# EAGLE design top_hk2 (EAGLE 9.3.1)
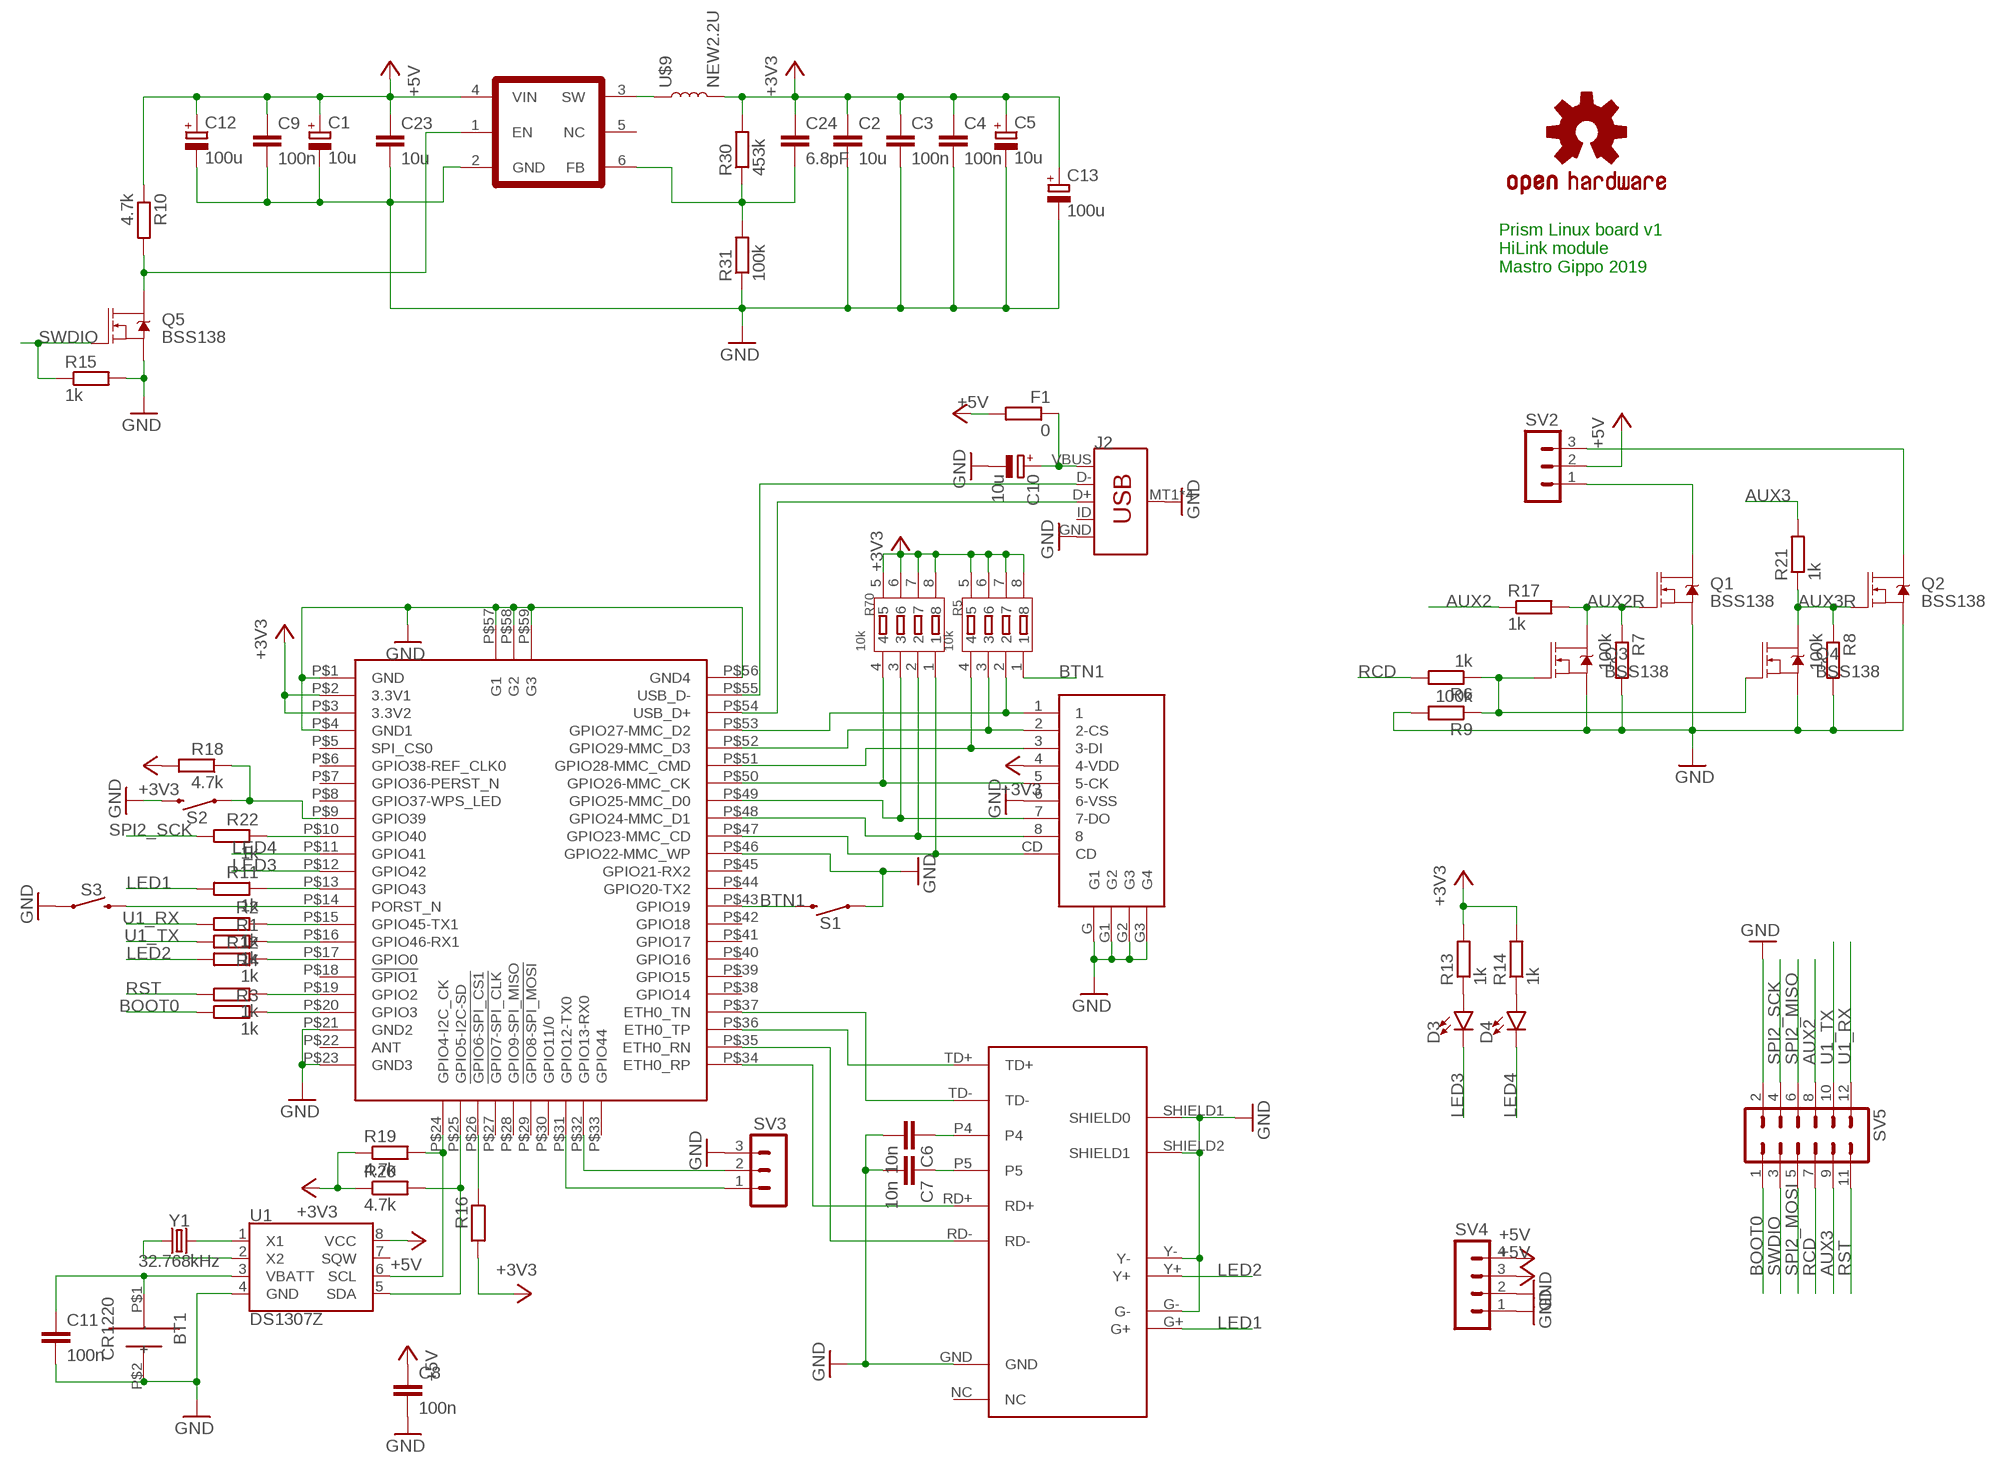
[diagram p0: schematic, sheet 1]

## Parts
BT1  CR1220  [CR1220]
C1  10u  CPOL-EUB/3528-21R  [B/3528-21R]
C2  10u  C-EUC0805K  [C0805K]
C3  100n  C-EUC0805K  [C0805K]
C4  100n  C-EUC0805K  [C0805K]
C5  10u  CPOL-EUB/3528-21R  [B/3528-21R]
C6  10n  C-EUC0805K  [C0805K]
C7  10n  C-EUC0805K  [C0805K]
C8  100n  C-EUC0805K  [C0805K]
C9  100n  C-EUC0805K  [C0805K]
C10  10u  CPOL-EUB/3528-21R  [B/3528-21R]
C11  100n  C-EUC0805K  [C0805K]
C12  100u  CPOL-EU153CLV-0505  [153CLV-0505]
C13  100u  CPOL-EU153CLV-0505  [153CLV-0505]
C23  10u  C-EUC0805K  [C0805K]
C24  6.8pF  C-EUC0805K  [C0805K]
D3  LED1206  [LED-1206]
D4  LED1206  [LED-1206]
F1  0  R-EU_R0603  [R0603]
J2  USB_MICRO-B_SMT  [USB-MICROB]
Q1  BSS138  MOSFET-NCH-BSS138  [SOT23-3]
Q2  BSS138  MOSFET-NCH-BSS138  [SOT23-3]
Q3  BSS138  MOSFET-NCH-BSS138  [SOT23-3]
Q4  BSS138  MOSFET-NCH-BSS138  [SOT23-3]
Q5  BSS138  MOSFET-NCH-BSS138  [SOT23-3]
R1  1k  R-EU_R0805  [R0805]
R2  1k  R-EU_R0805  [R0805]
R3  1k  R-EU_R0805  [R0805]
R4  1k  R-EU_R0805  [R0805]
R5  10k  SMD-RES-ARRAY-1K-4R(RA1206-8)  [RA1206-8]
R6  1k  R-EU_R0805  [R0805]
R7  100k  R-EU_R0805  [R0805]
R8  100k  R-EU_R0805  [R0805]
R9  100k  R-EU_R0805  [R0805]
R10  4.7k  R-EU_R0805  [R0805]
R11  1k  R-EU_R0805  [R0805]
R12  1k  R-EU_R0805  [R0805]
R13  1k  R-EU_R0805  [R0805]
R14  1k  R-EU_R0805  [R0805]
R15  1k  R-EU_R0805  [R0805]
R16  R-EU_R0805  [R0805]
R17  1k  R-EU_R0805  [R0805]
R18  4.7k  R-EU_R0805  [R0805]
R19  4.7k  R-EU_R0805  [R0805]
R20  4.7k  R-EU_R0805  [R0805]
R21  1k  R-EU_R0805  [R0805]
R22  1k  R-EU_R0805  [R0805]
R30  453k  R_EU  [R0805]
R31  100k  R_EU  [R0805]
R70  10k  SMD-RES-ARRAY-1K-4R(RA1206-8)  [RA1206-8]
S1  MOMENTARY-SWITCH-SPST-SMD-6.0X3.5MM  [TACTILE_SWITCH_SMD_6.0X3.5MM]
S2  MOMENTARY-SWITCH-SPST-SMD-6.0X3.5MM  [TACTILE_SWITCH_SMD_6.0X3.5MM]
S3  MOMENTARY-SWITCH-SPST-PTH-RIGHT-ANGLE  [TACTILE_SWITCH_PTH_RIGHT_ANGLE]
SV2  MA03-1  [MA03-1]
SV3  MA03-1  [MA03-1]
SV4  MA04-1  [MA04-1]
SV5  MA06-2  [MA06-2]
U1  DS1307Z  [SO08-0.15]
U$1  OSHW-LOGOS  [OSHW-LOGO-S]
U$2  HLK-7688A  [HLK-7688A]
U$3  MICRO_SD  [MICRO_SD_C]
U$4  HR911105A  [RJ45]
U$8  TLV62658  [SOT23-6]
U$9  NEW2.2U  [INDUCTOR_4X4MM]
Y1  32.768kHz  CRYSTAL-32.768KHZSMD-2X6  [CRYSTAL-SMD-2X6-CYL]

## Nets
+3V3: C2.1 C3.1 C4.1 C5.+ C13.+ C24.1 R5.5 R5.6 R5.7 R5.8 R13.2 R14.2 R16.2 R18.2 R19.1 R20.1 R30.2 R70.5 R70.6 R70.7 R70.8 U$2.P$2(3.3V1) U$2.P$3(3.3V2) U$3.4(4-VDD) U$9.P$2
+5V: C1.+ C8.1 C9.1 C12.+ C23.1 F1.2 R10.1 SV2.2 SV4.3 SV4.4 U1.8(VCC) U$8.4(VIN)
AUX2: R17.1 SV5.8
AUX2R: Q1.1(G) Q3.3(D) R7.1 R17.2
AUX3: R21.2 SV5.9
AUX3R: Q2.1(G) Q4.3(D) R8.1 R21.1
BOOT0: R3.2 SV5.1
BTN1: R5.1 S1.2 U$2.P$43(GPIO19)
GND: BT1.P$2(-) C1.- C2.2 C3.2 C4.2 C5.- C6.2 C7.2 C8.2 C9.2 C10.- C11.2 C12.- C13.- C23.2 J2.GND J2.MT1(SHIELD) J2.MT2(SHIELD) J2.P$1(SHIELD) J2.P$2(SHIELD) Q1.2(S) Q2.2(S) Q3.2(S) Q4.2(S) Q5.2(S) R7.2 R8.2 R9.2 R15.2 R31.1 S1.1 S2.2 S3.1 SV3.3 SV4.1 SV4.2 SV5.2 U1.4(GND) U$2.P$1(GND) U$2.P$4(GND1) U$2.P$21(GND2) U$2.P$23(GND3) U$2.P$46(GPIO22-MMC_WP) U$2.P$56(GND4) U$2.P$57(G1) U$2.P$58(G2) U$2.P$59(G3) U$3.6(6-VSS) U$3.G1(G2) U$3.G2(G3) U$3.G3(G4) U$3.G(G1) U$4.G- U$4.GND U$4.SHIELD1(SHIELD0) U$4.SHIELD2(SHIELD1) U$4.Y- U$8.2(GND)
LED1: R11.2 U$4.G+
LED2: R12.2 U$4.Y+
LED3: D3.C U$2.P$12(GPIO42)
LED4: D4.C U$2.P$11(GPIO41)
N$1: C6.1 U$4.P4
N$2: C7.1 U$4.P5
N$3: R2.1 U$2.P$15(GPIO45-TX1)
N$4: R1.1 U$2.P$16(GPIO46-RX1)
N$5: R5.3 U$2.P$52(GPIO29-MMC_D3) U$3.2(2-CS)
N$6: R5.4 U$2.P$51(GPIO28-MMC_CMD) U$3.3(3-DI)
N$7: R5.2 U$2.P$53(GPIO27-MMC_D2) U$3.1
N$8: R70.4 U$2.P$50(GPIO26-MMC_CK) U$3.5(5-CK)
N$9: U$2.P$36(ETH0_TP) U$4.TD+
N$10: R19.2 U1.6(SCL) U$2.P$24(GPIO4-I2C_CK)
N$11: R20.2 U1.5(SDA) U$2.P$25(GPIO5-I2C-SD)
N$12: R4.1 U$2.P$19(GPIO2)
N$13: R3.1 U$2.P$20(GPIO3)
N$14: R70.2 U$2.P$48(GPIO24-MMC_D1) U$3.8
N$15: R11.1 U$2.P$13(GPIO43)
N$16: Q5.3(D) R10.2 U$8.1(EN)
N$17: SV3.2 U$2.P$32(GPIO13-RX0)
N$18: SV3.1 U$2.P$31(GPIO12-TX0)
N$19: R16.1 U$2.P$26(!GPIO6-SPI_CS1)
N$20: R18.1 S2.1 U$2.P$9(GPIO39)
N$21: R22.1 U$2.P$10(GPIO40)
N$22: D3.A R13.1
N$23: D4.A R14.1
N$28: S3.2 U$2.P$14(PORST_N)
N$29: Q3.1(G) Q4.1(G) R6.1 R9.1
N$30: J2.D+ U$2.P$54(USB_D+)
N$31: J2.D- U$2.P$55(USB_D-)
N$32: C10.+ F1.1 J2.VBUS
N$33: R70.1 U$2.P$47(GPIO23-MMC_CD) U$3.CD
N$34: R70.3 U$2.P$49(GPIO25-MMC_D0) U$3.7(7-DO)
N$35: U1.2(X2) Y1.X1
N$36: U1.1(X1) Y1.X2
N$37: BT1.P$1(+) C11.1 U1.3(VBATT)
N$38: Q1.3(D) SV2.1
N$39: U$2.P$37(ETH0_TN) U$4.TD-
N$40: U$2.P$35(ETH0_RN) U$4.RD-
N$41: U$8.3(SW) U$9.P$1
N$42: U$2.P$34(ETH0_RP) U$4.RD+
N$43: Q2.3(D) SV2.3
N$45: R12.1 U$2.P$17(GPIO0)
N$46: C24.2 R30.1 R31.2 U$8.6(FB)
RCD: R6.2 SV5.7
RST: R4.2 SV5.11
SPI2_MISO: SV5.6
SPI2_MOSI: SV5.5
SPI2_SCK: R22.2 SV5.4
SWDIO: Q5.1(G) R15.1 SV5.3
U1_RX: R2.2 SV5.12
U1_TX: R1.2 SV5.10
Unconnected: J2.ID U1.7(SQW) U$2.P$5(SPI_CS0) U$2.P$6(GPIO38-REF_CLK0) U$2.P$7(GPIO36-PERST_N) U$2.P$8(GPIO37-WPS_LED) U$2.P$18(!GPIO1) U$2.P$22(ANT) U$2.P$27(!GPIO7-SPI_CLK) U$2.P$28(GPIO9-SPI_MISO) U$2.P$29(!GPIO8-SPI_MOSI) U$2.P$30(GPIO11/0) U$2.P$33(GPIO44) U$2.P$38(GPIO14) U$2.P$39(GPIO15) U$2.P$40(GPIO16) U$2.P$41(GPIO17) U$2.P$42(GPIO18) U$2.P$44(GPIO20-TX2) U$2.P$45(GPIO21-RX2) U$4.NC U$8.5(NC)

## Notes on the sheet
- Prism Linux board v1
  HiLink module
  Mastro Gippo 2019

## Library data of the parts
BT1 = mastrogippo:CR1220
C1 C5 C10 C12 C13 = rcl:CPOL-EU: POLARIZED CAPACITOR, European symbol; SPICEPREFIX: C
C2-C4 C6-C9 C11 C23 C24 = resistor:C-EU: CAPACITOR, European symbol
D3 D4 = SparkFun-LED:LED: LED (Generic) Standard schematic elements and footprints for 5mm, 3mm, 1206, and 0603 sized LEDs. Generic LEDs with no color specified.
F1 R1-R4 R6-R22 = rcl:R-EU_: RESISTOR, European symbol; SPICEPREFIX: R
J2 = SparkFun-Connectors:USB_MICRO-B: USB Type Micro-B Connector Male/female and PTH/SMT variants SparkFun Products: SparkFun microB USB Breakout <https://www.sparkfun.com/products/12035> SparkFun USB microB Plug Breakout <https://www.sparkfun.com/products/10031> SparkFun ESP8266 Thing <https://www.sparkfun.com/products/13231>; PROD_ID: CONN-09505; SF_ID: PRT-08533
Q1-Q5 = SparkFun-DiscreteSemi:MOSFET-NCH: N-channel MOSFETs Voltage controlled devices that allow control of high current outputs. SparkFun Products: SparkFun OpenScale <https://www.sparkfun.com/products/13261> SparkFun Digital Sandbox <https://www.sparkfun.com/products/12651> SparkFun Monster Moto Shield <https://www.sparkfun.com/products/10182> SparkFun MOSFET Power Controller <https://www.sparkfun.com/products/11214>; PROD_ID: TRANS-00830; VALUE: 220mA/50V/3.5Ω
R5 R70 = Seeed-Resistor-2016:SMD-RES-ARRAY-1K-4R(RA1206-8): 301030012; MPN: Chip-Array-Series-1%; VALUE: 1K
R30 R31 = mastrogippo:R_EU
S1 S2 = SparkFun-Switches:MOMENTARY-SWITCH-SPST: Momentary Switch (Pushbutton) - SPST Normally-open (NO) SPST momentary switches (buttons, pushbuttons). Variants PTH-12MM - 12mm square, through-hole Momentary Pushbutton Switch - 12mm Square <https://www.sparkfun.com/products/9190> (COM-09190) PTH-6.0MM, PTH-6.0MM-KIT - 6.0mm square, through-hole Mini Pushbutton Switch <https://www.sparkfun.com/products/97> (COM-00097) KIT package intended for soldering kit's - only one side of pads' copper is exposed. PTH-RIGHT-ANGLE-KIT - Right-angle, through-hole Right Angle Tactile Button <https://www.sparkfun.com/products/10791> - Used on SparkFun BigTime Watch Kit <https://www.sparkfun.com/products/11734> SMD-12MM - 12mm square, surface-mount Tactile Button - SMD (12mm) <https://www.sparkfun.com/products/12993> (COM-12993) Used on SparkFun PicoBoard <https://www.sparkfun.com/products/11888> SMD-4.5MM - 4.5mm Square Trackball Switch Used on SparkFun Blackberry Trackballer Breakout <https://www.sparkfun.com/products/13169> SMD-4.6MMX2.8MM - 4.60mm x 2.80mm, surface mount Used on SparkFun SAMD21 Mini Breakout <https://www.sparkfun.com/products/13664> SMD-5.2MM, SMD-5.2-REDUNDANT - 5.2mm square, surface-mount Mini Pushbutton Switch - SMD <https://www.sparkfun.com/products/8720> (COM-08720) Used on Arduino Pro Mini <https://www.sparkfun.com/products/11114> REDUNDANT package connects both switch circuits together SMD-6.0X3.5MM - 6.0 x 3.5mm, surface mount Momentary Reset Switch SMD <https://www.sparkfun.com/products/8229> (COM-08229) SMD-6.2MM-TALL - 6.2mm square, surface mount Tactile Button - SMD (6mm) <https://www.sparkfun.com/products/12992> Used on SparkFun Digital Sandbox <https://www.sparkfun.com/products/12651> SMD-RIGHT-ANGLE - Right-angle, surface mount Used on SparkFun Block for Intel® Edison - Arduino <https://www.sparkfun.com/products/13036>; PROD_ID: SWCH-00815; SF_SKU: COM-08229
S3 = SparkFun-Switches:MOMENTARY-SWITCH-SPST: Momentary Switch (Pushbutton) - SPST Normally-open (NO) SPST momentary switches (buttons, pushbuttons). Variants PTH-12MM - 12mm square, through-hole Momentary Pushbutton Switch - 12mm Square <https://www.sparkfun.com/products/9190> (COM-09190) PTH-6.0MM, PTH-6.0MM-KIT - 6.0mm square, through-hole Mini Pushbutton Switch <https://www.sparkfun.com/products/97> (COM-00097) KIT package intended for soldering kit's - only one side of pads' copper is exposed. PTH-RIGHT-ANGLE-KIT - Right-angle, through-hole Right Angle Tactile Button <https://www.sparkfun.com/products/10791> - Used on SparkFun BigTime Watch Kit <https://www.sparkfun.com/products/11734> SMD-12MM - 12mm square, surface-mount Tactile Button - SMD (12mm) <https://www.sparkfun.com/products/12993> (COM-12993) Used on SparkFun PicoBoard <https://www.sparkfun.com/products/11888> SMD-4.5MM - 4.5mm Square Trackball Switch Used on SparkFun Blackberry Trackballer Breakout <https://www.sparkfun.com/products/13169> SMD-4.6MMX2.8MM - 4.60mm x 2.80mm, surface mount Used on SparkFun SAMD21 Mini Breakout <https://www.sparkfun.com/products/13664> SMD-5.2MM, SMD-5.2-REDUNDANT - 5.2mm square, surface-mount Mini Pushbutton Switch - SMD <https://www.sparkfun.com/products/8720> (COM-08720) Used on Arduino Pro Mini <https://www.sparkfun.com/products/11114> REDUNDANT package connects both switch circuits together SMD-6.0X3.5MM - 6.0 x 3.5mm, surface mount Momentary Reset Switch SMD <https://www.sparkfun.com/products/8229> (COM-08229) SMD-6.2MM-TALL - 6.2mm square, surface mount Tactile Button - SMD (6mm) <https://www.sparkfun.com/products/12992> Used on SparkFun Digital Sandbox <https://www.sparkfun.com/products/12651> SMD-RIGHT-ANGLE - Right-angle, surface mount Used on SparkFun Block for Intel® Edison - Arduino <https://www.sparkfun.com/products/13036>; PROD_ID: CONN-10672; SF_SKU: COM-10791
SV2 SV3 = con-lstb:MA03-1: PIN HEADER; OC_FARNELL: unknown; OC_NEWARK: unknown
SV4 = con-lstb:MA04-1: PIN HEADER; OC_FARNELL: unknown; OC_NEWARK: unknown
SV5 = con-lstb:MA06-2: PIN HEADER; OC_FARNELL: unknown; OC_NEWARK: unknown
U1 = SparkFun-Clocks:DS1307: Maxim DS1307 - I2C Real-time clock (RTC) The DS1307 serial real-time clock (RTC) is a low-power, full binary-coded decimal (BCD) clock/calendar plus 56 bytes of NV SRAM. Address and data are transferred serially through an I2C, bidirectional bus. The clock/calendar provides seconds, minutes, hours, day, date, month, and year information. SparkFun Products: Real Time Clock Module <https://www.sparkfun.com/products/12708> (BOB-12708) Datasheet <https://cdn.sparkfun.com/datasheets/BreakoutBoards/DS1307.pdf>; PROD_ID: IC-08138
U$1 = mastrogippo:OSHW-LOGO: Open Source Hardware Logo This logo indicates the piece of hardware it is found on incorporates a OSHW license and/or adheres to the definition of open source hardware found here: http://freedomdefined.org/OSHW
U$2 = mastrogippo:HLK-7688A
U$3 = DueCan:MICRO_SD
U$4 = HR911105A:HR911105A
U$8 = mastrogippo:TLV62658
U$9 = SparkFun-Coils:NEW2.2U
Y1 = SparkFun-Clocks:CRYSTAL-32.768KHZ: 32.768kHz Crystal Frequency: 32.768kHz Frequency Stability: ±20ppm Load Capacitance: 12.5pF (PTH-2X6 & SMD-3.2X1.5), 6pF (SMD-2X6) SparkFun Products: SparkFun BigTime Watch Kit <https://www.sparkfun.com/products/11734> SparkFun nRF52832 Breakout <https://www.sparkfun.com/products/13990> SparkFun Real Time Clock Module <https://www.sparkfun.com/products/12708>; PROD_ID: XTAL-07894

## Board
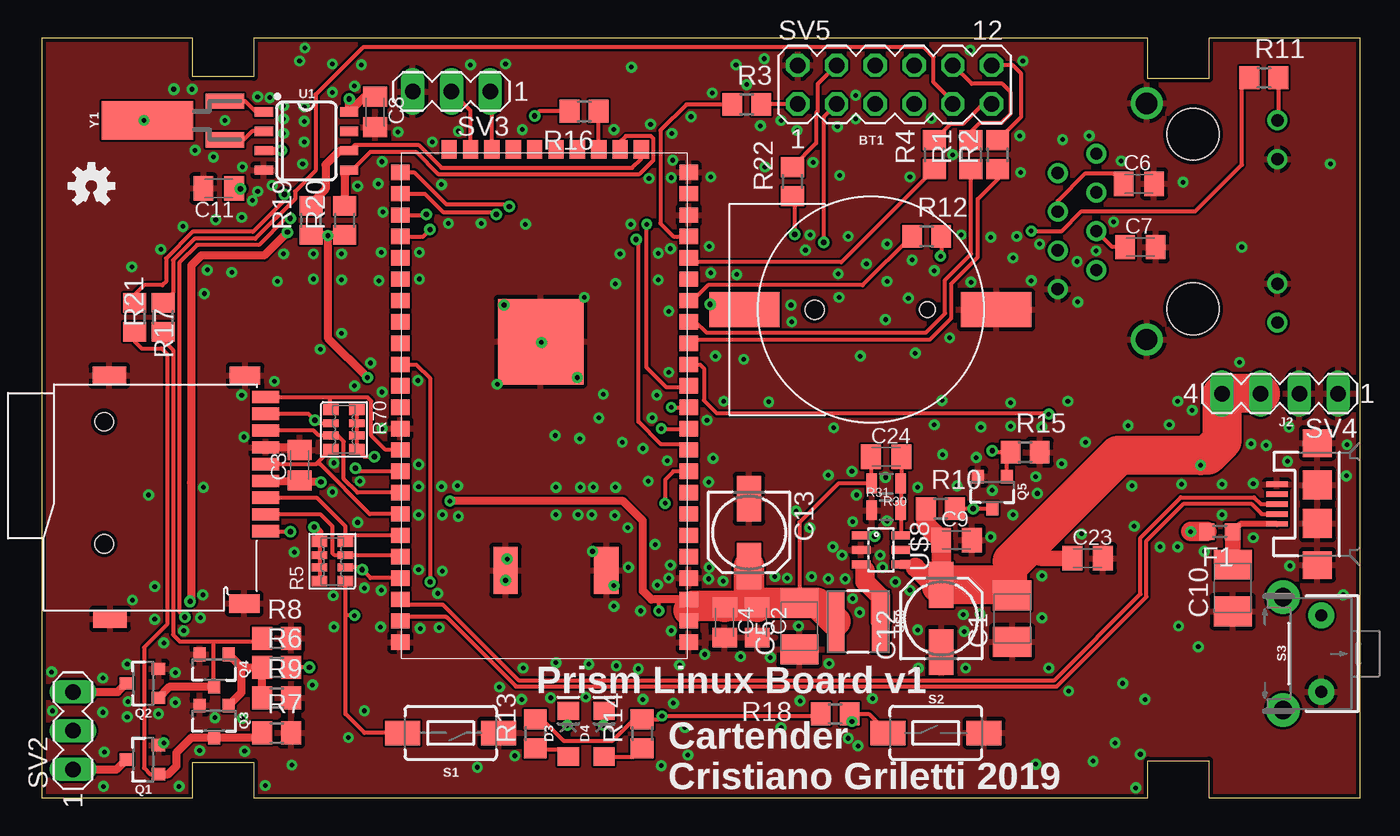
[diagram p1: board, top side]
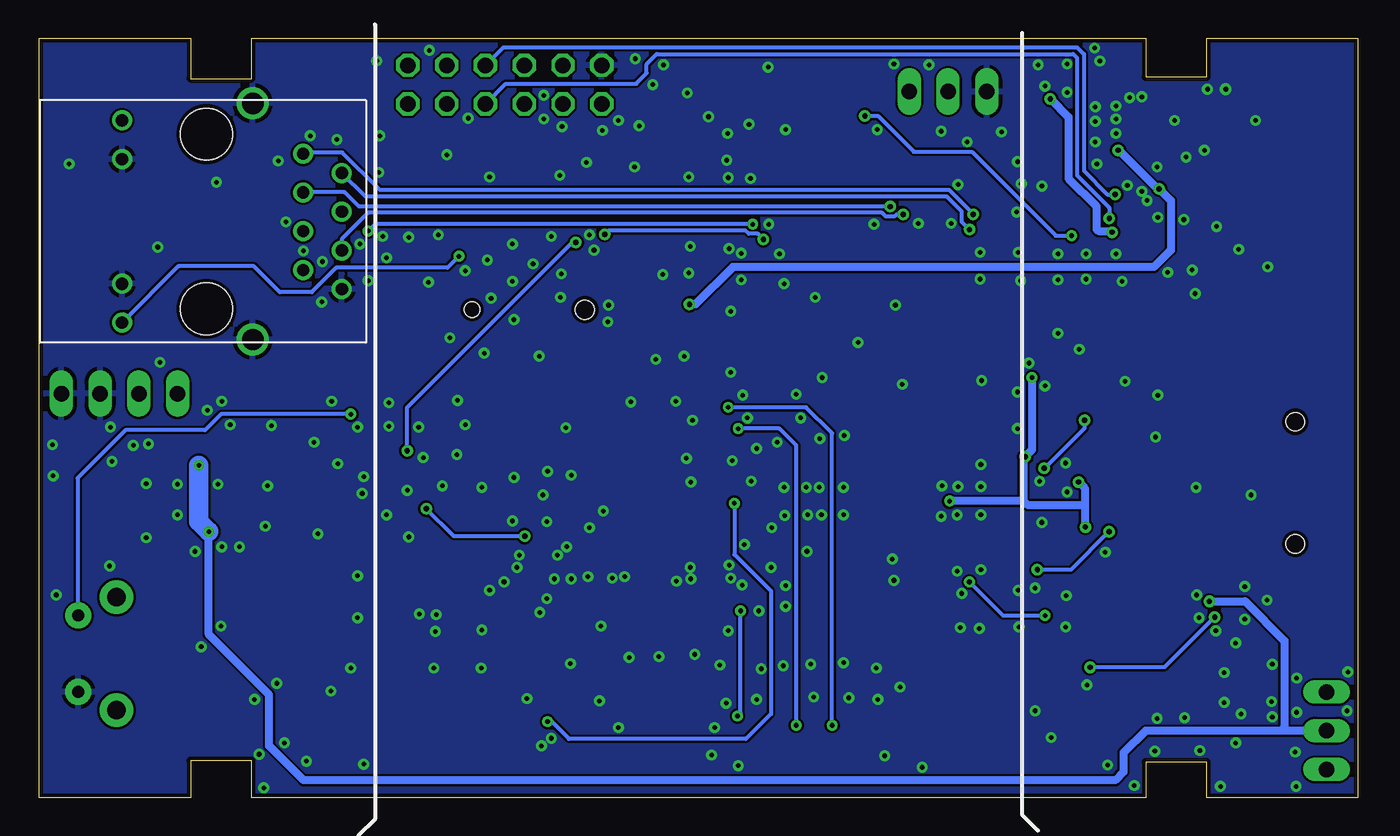
[diagram p2: board, bottom side, seen from below]

Size 86.4 x 49.8 mm. Coordinates in mm from the lower left corner, seen from the top.
Outline: 0,49.8 0,0 9.9,0 9.9,2.34 13.9,2.34 13.9,0 72.5,0 72.5,2.44 76.5,2.44 76.5,0 86.4,0 86.4,49.8 76.5,49.8 76.5,47.16 72.5,47.16 72.5,49.8 13.9,49.8 13.9,47.26 9.9,47.26 9.9,49.8 0,49.8
Copper layers (1*16): Top 0.035mm / dielectric 1.5mm / Bottom 0.035mm
Design rules "default *": minimum track width 6mil, minimum drill 0.3mm, track to track 6mil, track to pad 6mil, pad to pad 6mil, via to via 6mil, smd to smd 6mil, copper to edge 10mil, drill to drill 6mil, minimum pad ring 10mil, minimum via ring 8mil, stop-mask expansion 4mil, vias tented up to drill 20mil, thermal gap 10mil

### Footprints (pad centres in the part's own frame; a part is rotated, then mirrored left to right if it is on the bottom)
CR1220 = smd 2.3 x 4.6: P$1 0,-8.3; P$2 0,8.2 | hole 1.25: 0,-3.7 | hole 1: 0,3.7
B/3528-21R = smd 1.95 x 2.5: + 1.525,0; - -1.525,0
C0805K = smd 1.3 x 1.6: 1 -1,0; 2 1,0
153CLV-0505 = smd 3 x 1.6: + 2.2,0; - -2.2,0
LED-1206 = smd 1.2 x 1.4: A -1.5,0; C 1.5,0
R0603 = smd 1 x 1.1: 1 -0.85,0; 2 0.85,0
USB-MICROB = smd 1.4 x 0.35: D+ -2.65,0; D- -2.65,-0.65; GND -2.65,1.3; ID -2.65,0.65; VBUS -2.65,-1.3 | smd 1.9 x 1.8: MT1 0,-4; MT2 0,4 | smd 1.9 x 1.9: P$1 0,-1.27; P$2 0,1.27
SOT23-3 = smd 0.8 x 0.9: 1 -0.95,-1; 2 0.95,-1; 3 0,1.1
R0805 = smd 1.3 x 1.5: 1 -0.95,0; 2 0.95,0
RA1206-8 = smd 0.7 x 1: 1 -1.3,-0.85; 4 1.3,-0.85; 5 1.3,0.85; 8 -1.3,0.85 | smd 0.5 x 1: 2 -0.4,-0.85; 3 0.4,-0.85; 6 0.4,0.85; 7 -0.4,0.85
R0805' = smd 0.7 x 1.3: 1 -0.95,0; 2 0.95,0
TACTILE_SWITCH_SMD_6.0X3.5MM = smd 2.3 x 1.6: 1 -3.15,0; 2 3.15,0
TACTILE_SWITCH_PTH_RIGHT_ANGLE = drill 0.8 pad 1.7: 1 -2.5,0; 2 2.5,0 | drill 1.2 pad 2.2: ANCHOR1 -3.703,2.5; ANCHOR2 3.703,2.5
MA03-1 = drill 1.016 long: 1 -2.54,0; 2 0,0; 3 2.54,0
MA04-1 = drill 1.016 long: 1 -3.81,0; 2 -1.27,0; 3 1.27,0; 4 3.81,0
MA06-2 = drill 1.016 octagon: 1 -6.35,-1.27; 2 -6.35,1.27; 3 -3.81,-1.27; 4 -3.81,1.27; 5 -1.27,-1.27; 6 -1.27,1.27; 7 1.27,-1.27; 8 1.27,1.27; 9 3.81,-1.27; 10 3.81,1.27; 11 6.35,-1.27; 12 6.35,1.27
SO08-0.15 = smd 0.6 x 1.2: 1 -1.905,-2.8; 2 -0.635,-2.8; 3 0.635,-2.8; 4 1.905,-2.8; 5 1.905,2.8; 6 0.635,2.8; 7 -0.635,2.8; 8 -1.905,2.8
HLK-7688A = smd 1 x 1.2: P$1 32.1,18.8; P$2 30.7,18.8; P$3 29.3,18.8; P$4 27.9,18.8; P$5 26.5,18.8; P$6 25.1,18.8; P$7 23.7,18.8; P$8 22.3,18.8; P$9 20.9,18.8; P$10 19.5,18.8; P$11 18.1,18.8; P$12 16.7,18.8; P$13 15.3,18.8; P$14 13.9,18.8; P$15 12.5,18.8; P$16 11.1,18.8; P$17 9.7,18.8; P$18 8.3,18.8; P$19 6.9,18.8; P$20 5.5,18.8; P$21 4.1,18.8; P$22 2.7,18.8; P$23 1.3,18.8; P$34 1.3,-0.1; P$35 2.7,-0.1; P$36 4.1,-0.1; P$37 5.5,-0.1; P$38 6.9,-0.1; P$39 8.3,-0.1; P$40 9.7,-0.1; P$41 11.1,-0.1; P$42 12.5,-0.1; P$43 13.9,-0.1; P$44 15.3,-0.1; P$45 16.7,-0.1; P$46 18.1,-0.1; P$47 19.5,-0.1; P$48 20.9,-0.1; P$49 22.3,-0.1; P$50 23.7,-0.1; P$51 25.1,-0.1; P$52 26.5,-0.1; P$53 27.9,-0.1; P$54 29.3,-0.1; P$55 30.7,-0.1; P$56 32.1,-0.1 | smd 1.2 x 1: P$24 -0.2,15.7; P$25 -0.2,14.3; P$26 -0.2,12.9; P$27 -0.2,11.5; P$28 -0.2,10.1; P$29 -0.2,8.7; P$30 -0.2,7.3; P$31 -0.2,5.9; P$32 -0.2,4.5; P$33 -0.2,3.1 | smd 5.6 x 5.6: P$57 12.4,9.1 | smd 3.1 x 1.6: P$58 27.4,6.8; P$59 27.4,13.4
MICRO_SD_C = smd 0.8 x 1.75: 1 2.83,7.07; 2 1.73,7.07; 3 0.63,7.07; 4 -0.47,7.07; 5 -1.57,7.07; 6 -2.67,7.07; 7 -3.77,7.07; 8 -4.87,7.07; CD -5.97,7.07 | smd 1.2 x 2: G 7.57,5.68; G1 -7.38,5.73 | smd 1.2 x 2.2: G2 -7.38,-3.17; G3 8.57,-3.12 | hole 1.2: -4.35,-3.5; 3.65,-3.5
RJ45 = drill 0.8: G+ 5.84,-6.305; G- 5.84,-3.765; GND -8.57,4.76; NC -6.03,3.5; P4 -8.57,-0.32; P5 -6.03,0.96; RD+ -6.03,-1.58; RD- -8.57,2.22; TD+ -6.03,-4.12; TD- -8.57,-2.86; Y+ 5.84,6.945; Y- 5.84,4.405 | drill 1.4: SHIELD1 -2.73,-7.425; SHIELD2 -2.73,8.065 | hole 3.4: 0.3,6.05; 0.3,-5.4
SOT23-6 = smd 0.55 x 1.2: 1 -0.95,-1.3; 2 0,-1.3; 3 0.95,-1.3; 4 0.95,1.3; 5 0,1.3; 6 -0.95,1.3
INDUCTOR_4X4MM = smd 4.089 x 1.143: P$1 0,1.473; P$2 0,-1.473
CRYSTAL-SMD-2X6-CYL = smd 2.5 x 6: SHEILD 0,5.08 | smd 1 x 2.5: X1 -1.27,0; X2 1.27,0

### Placement (x,y rotation side)
BT1  54.35,32 270 top
C1  63.6,11.75 90 top
C2  46.9,11.5 270 top
C3  16.9,21.8 90 top
C4  44.75,11.5 270 top
C5  49.65,11.25 90 top
C6  71.9,40.25 0 top
C7  72,36.1 0 top
C8  21.85,44.95 270 top
C9  59.95,16.9 0 top
C10  78.05,13.75 90 top
C11  11.6,39.95 180 top
C12  58.95,11.75 90 top
C13  46.35,17.4 270 top
C23  68.55,15.7 0 top
C24  55.35,22.35 0 top
D3  34.5,4.2 90 top
D4  36.85,4.2 90 top
F1  77.2,17.45 180 top
J2  83.6,19.25 0 top
Q1  6.65,2.5 90 top
Q2  6.65,7.5 90 top
Q3  11.3,5.05 180 top
Q4  11.3,8.4 180 top
Q5  62.3,20.05 180 top
R1  60.9,42.15 90 top
R2  62.65,42.15 90 top
R3  46.2,45.45 0 top
R4  58.5,42.15 90 top
R5  19.05,15.5 90 top
R6  15.4,8.55 0 top
R7  15.4,4.25 0 top
R8  15.4,10.45 0 top
R9  15.4,6.55 0 top
R10  58.9,18.95 0 top
R11  80.1,47.2 0 top
R12  58,36.8 0 top
R13  32.35,4.2 90 top
R14  39.35,4.2 90 top
R15  64.45,22.65 0 top
R16  35.55,45 180 top
R17  6.1,31.5 270 top
R18  52,5.5 180 top
R19  17.65,37.85 90 top
R20  19.85,37.85 90 top
R21  7.95,31.5 90 top
R22  49.2,40.4 90 top
R30  453k  [R0805']  55.35,20.6 180 top
R31  100k  [R0805']  55.35,18.85 0 top
R70  19.8,24.15 270 top
S1  26.8,4.25 180 top
S2  58.6,4.25 0 top
S3  83.85,9.45 90 top
SV2  2.05,4.4 90 top
SV3  26.85,46.3 180 top
SV4  81.15,26.5 180 top
SV5  55.9,46.75 0 top
U1  17.35,43.05 270 top
U$1  3.25,40.1 0 top
U$2  23.6,42.3 270 top
U$3  7.6,20.3 270 top
U$4  75.15,38.1 180 bottom
U$8  55,16.25 270 top
U$9  53.5,11.55 270 top
Y1  12,44.4 90 top

### Tracks (layer width: path | path; a pad name or v marks a point on that pad's centre or on a via)
+3V3  (via drill 0.3, 0.35)
  Top 0.254: R5.5 R5.6 R5.7 R5.8 | v21.8,22.35 21.15,22.35 R70.5 R70.6 R70.7 R70.8 | R13.2 32.8,5.15 34.2,3.75 37.4,3.75 38.9,5.25 39.25,5.25 R14.2 40.45,5.15 v40.65,5.35 50.9,5.35 R18.2 | v40.45,12.25 40.45,13 | R16.2 32.6,45 v32.3,44.7 | C5.+ 49.65,18.05 52.2,20.6 R30.2 54.35,20.65 C24.1
  Top 0.508: R5.5 18.2,17.4 v17.85,17.75 | v18.3,20.7 17,20.7 16.93,20.77 | 16.93,20.77 C3.1 | U$2.P$3 40.45,13 39.95,13 39.4,13.55 39.4,18.15 38.1,19.45 v26.75,19.45 | v18.75,36.85 18.7,36.9 R19.1 | R20.1 18.8,36.9 v18.75,36.85 | v18.75,36.85 18.75,30.15 v21.35,27.55 | U$3.4 16.93,20.77
  Top 0.813: U$2.P$3 42.4,12.3 | 42.4,12.3 U$2.P$2 | 42.8,12.3 42.4,12.3
  Top 2: U$9.P$2 50.8,12.78 C5.+ 47.15,12.78 46.95,12.58 | 46.95,12.58 44.83,12.58 | 44.83,12.58 42.68,12.58 42.4,12.3 | C4.1 44.83,12.58 | 46.95,12.58 46.9,12.53 C2.1 46.35,13.05 C13.+
  Bottom 0.254: v40.65,5.35 40.45,5.55 v40.45,12.25 | v32.3,44.7 31.45,44.7 29.1,42.35 25.3,42.35 19.8,36.85 v18.75,36.85
  Bottom 0.508: 17.9,19.2 17.9,17.8 v17.85,17.75 | v18.3,20.7 17.9,20.3 17.9,19.2 | 21.9,19.45 v26.75,19.45 | v21.35,27.55 21.35,22.8 v21.8,22.35 21.9,22.25 21.9,19.45 | 21.9,19.45 21.65,19.2 17.9,19.2
+5V  (via drill 0.3, 0.35)
  Top 0.254: C1.+ 62.93,13.95
  Top 0.508: C8.1 21.15,45.95 U1.8 v20.15,45.82 | v16.1,37.08 14.57,35.55 10.45,35.55 9.8,34.9 9.8,20.68 9.79,20.67 9.79,12.99 9.8,12.98 9.8,12.95 v9.73,12.88 | C1.+ 64.35,14.03 64.35,15.15 63.95,15.15 63.6,15.5
  Top 0.61: U$8.4 57.05,15.3 57.25,15.1
  Top 1.016: C23.1 65.53,15.7 63.6,16.12 63.6,15.5
  Top 1.27: 76.4,22.45 75.95,22 v75.95,21.8 | v75.3,17.45 F1.2 | R10.1 57.95,17.9 C9.1 C12.+ 58.4,13.95 57.25,15.1
  Top 2.54: SV4.3 SV4.4 77.34,23.39 76.4,22.45 70.55,22.45 63.6,15.5 | 62.93,13.95 C12.+
  Bottom 0.508: SV2.2 5.05,4.4 | 5.05,4.4 13.9,4.4 15.35,2.95 15.35,1.7 15.9,1.15 69.1,1.15 71.35,3.4 71.35,6.75 75.3,10.7 v75.3,17.45 | v20.15,45.82 18.95,44.62 18.95,40.6 17.13,38.78 17.13,37.28 17,37.15 16.17,37.15 v16.1,37.08 | v9.73,12.88 7.38,12.88 4.8,10.3 4.8,4.65 5.05,4.4
  Bottom 1.27: v75.95,21.8 75.95,18.1 v75.3,17.45
AUX2  (via drill 0.35)
  Top 0.254: v15.9,39.55 15.9,39.15 13.85,37.1 9.9,37.1 8.15,35.35 8.15,33.85 7.9,33.6 6.7,33.6 6.1,33 R17.1
  Bottom 0.254: SV5.8 55.99,49.2 18.4,49.2 17.95,48.75 17.95,41.1 16.4,39.55 v15.9,39.55
AUX2R
  Top 0.254: R17.2 6.1,29.9 6.55,29.45 7.85,29.45 8.21,29.1 8.21,11.36 6.7,9.85 6.7,1.95 7.1,1.55 Q1.1
  Top 0.508: Q1.1 8.3,1.55 8.83,2.08 8.83,2.97 9.82,3.95 Q3.3 14.15,3.95 R7.1
AUX3
  Top 0.254: SV5.9 59.71,45.64 58.45,46.9 58.45,48.55 57.8,49.2 21.05,49.2 17.95,46.1 17.95,41.1 16.6,39.75 16.6,39.25 13.99,36.65 10.02,36.65 8.61,35.24 8.61,33.11 R21.2
AUX3R
  Top 0.254: R21.1 7.95,30 8.61,29.34 8.61,10.69 9.05,10.25 11.25,10.25 | R8.1 14.25,10.25 11.25,10.25 | 11.25,10.25 11.25,7.35 Q4.3
  Top 0.508: Q2.1 8.4,7.3 Q4.3
BOOT0
  Top 0.254: SV5.1 47.18,45.48 R3.2
BTN1  (via drill 0.3)
  Top 0.254: S1.2 21.15,4.25 19.9,5.5 19.9,11.95 | 19.9,11.95 R5.1 | U$2.P$43 24.55,28.4 25.45,27.5 v25.45,14.15 | v20.5,11.95 19.9,11.95
  Bottom 0.254: v25.45,14.15 23.25,11.95 v20.5,11.95
GND  (via drill 0.3, 0.35)
  Top 0.508: C3.2 16.73,22.97 U$3.6
  other vias: 74.8,40.35 78.65,36.1 84.45,41.55 8.65,46.45 38.65,47.9 57.05,35.25 55.4,36.3 60.25,36.9 59.7,42.15 65.4,36.3 63.65,35.4 56.9,40.7 58.3,44.55 60.85,49 64.3,48.3 64.1,43.4 64.15,41 63.9,36.8 62.2,36.75 70.75,41.75 68.65,43.4 66.9,43.15 70.25,37.75 69.1,35.85 81.75,24.3 81.65,22.05 80.25,23.1 85.5,21.1 85.55,23.15 85.3,13.3 81.8,15.2 79.4,20.6 79.25,23.2 77.35,20.55 74.7,20.55 75.4,25.4 74.45,26 68.4,23.3 73.9,24.45 67.25,26 71.2,24.4 71.45,20.45 73.3,16.45 71.6,17.8 77.35,18.55 79.4,17.05 76.2,16.15 74.45,16.45 74.5,11.25 72.3,6.45 75.8,9.9 70.85,7.5 67.3,7 66,8.5 71.7,0.65 72,2.85 70.35,3.6 68.9,2.4 65.15,2.2 40.6,2.1 28.55,2 41.4,6.2 39.4,6.45 39.1,8.45 41.8,8.7 37.65,8.65 35.85,8.75 33.7,8.85 33.35,6.55 35.65,6.6 31,2.75 31.45,6.45 31.55,8.5 30,7.25 26.05,11.15 25.95,13.4 20.1,3.95 21.15,5.7 16.4,2.15 14.65,0.8 13.3,3.05 10.35,3.1 8,3.6 7.4,13.85 8.75,6.25 8.75,8.2 13.15,5.2 17.75,7.4 9,0.75 4.05,0.75 4.1,3 4,5.6 4,7.85 5.6,8.75 8,10.15 10.4,11.8 9.3,10.95 7.4,11.7 10.65,33.05 10.85,34.6 9.25,37.45 7.8,35.95 13.1,26.4 15.25,27.3 20.5,27 22.3,26.6 22.3,24.2 24.65,27.35 20.7,18.05 20.85,20.75 13.25,23.65 16.55,16.1 21.15,13.75 22.25,13.6 24.7,14.95 24.7,18.55 24.7,20.4 26.2,20.4 26.25,18.55 27.3,18.45 27.25,20.45 26.25,14.85 24.8,11.1 22.2,11.2 19.15,11.2 19.1,13.25 21.55,28.5 22.3,41.7 22.05,40.25 20.7,40.1 22.25,35.75 19.65,35.65 17.8,35.65 17.2,43 12.45,34.45 15.45,33.85 13.8,39.15 17.1,41.55 17.2,45.3 13.15,41.35 14.15,39.75 13.1,38.05 11.4,37.9 15.85,35.65 26.65,37.65 24.75,35.75 24.75,34 22.1,33.9 37.9,35.65 40.4,35.7 40.4,33.95 37.6,33.7 43.85,34.4 45.55,34.3 46,28.75 41.1,31.9 52.25,32.8 41.1,27.9 44.15,28.95 49.1,32.3 49.15,31.2 44.7,26 47.65,25.95 43.6,24.75 40,24.9 40.3,26.4 38.6,37.6 39.8,40.6 41.35,41.8 41.25,40.65 41.3,43.55 42.55,44.65 39.9,44.15 43.95,46.2 37.5,43.8 31.5,43.8 27.3,43.7 30.4,48.1 19.05,48.1 23.35,43.65 31.7,37.6 28.8,37.65 26.2,40.2 53.35,44.5 46.2,46.75 48.45,44.4 52.85,36.8 52.2,34.35 55.3,31.35 53.65,28.95 56.8,32.75 60.9,33.8 43.75,36.15 43.85,40.7 67.85,35.15 67.9,32.5 64.85,33.9 41.1,14.4 41.25,10.95 43.45,9.4 39.25,12.25 37.5,12.55 37.55,18.5 38.4,17.7 40.35,13.95 37.6,20.35 36.5,24.9 38.05,23.3 39.4,22.9 36.8,26.45 33.65,23.75 35.25,23.55 35.3,20.35 36.15,20.35 33.7,20.35 33.7,18.55 35.15,18.55 36.05,18.55 6.7,44.4 10.05,42.45 12,44.4 9.85,46.45 14.15,45.95 15.1,40.15 15.85,43.55 15.85,44.5 15.85,45.35 14.95,45.9 5.9,34.8 11.25,42 7,19.85 10.6,20.35 10.55,13.3 19.15,21.95 17.25,49.15 16.9,48.3 17.2,44.35 35.1,27.55 32.75,29.85 30.3,32.3 29.85,27.1 35.55,32.8 30.5,15.65 30.4,14.25 37.5,13.9 36.1,16.15 11.35,5.25 24.7,21.85 19.05,20.05 17.8,34 19.65,33.95 18.25,29.4 19.65,30.45 25.6,43 28.1,48.05 20.95,48.05 19.05,46.25 20.5,46.65 59.5,30.15 57.25,29.15 50.05,35.9 52.3,40.8 47.4,41.35 52.15,44 49.5,43.75 22.35,38.4 53.5,3.4 49.7,6.35 54.45,6.5 48.45,4.6 52.85,3.9 42.35,2.8 44,22.25 39.75,20.75 61.25,22.3 59.05,22.5 59,26.05 61.55,24.3 63.5,25.9 63.5,24.35 65.55,24.3 55.4,33.85 54.05,35 41.2,36 5.95,12.95 5.65,6.3 7.65,5.5 5.6,5.3 0.7,5.7 0.65,8.25 42.15,4.6 38.45,15.1 40.2,16.6 41.2,15.25 43.7,20.7 41,22.1 43.7,14.35 43.75,15.1 44.65,14.2 48.05,14.5 48.85,14.4 50.45,14.5 51.55,14.35 50.35,17.7 49.45,18.8 53.1,21.4 53.4,19.85 57.4,20.35 53.15,18.1 53.15,13.05 52.65,14.35 53.6,12.15 55.95,14.15 54.95,15.9 51.85,16.45 52.45,15.9 55.1,15.1 60.4,12 61.5,12.05 65.55,11.8 62.2,17.1 63.65,18.55 65.15,21.05 65.25,19.95 66.85,21.9 58.5,24.45 51.9,24.25 58.5,34.55 51.55,21.15 55.3,21 55.4,18.15 49.6,11.25 51.6,8.8 47.75,9.2 45.8,9.25 57.45,8.5 60.55,8.5 60.45,10.9 57.4,11 65.55,14.55 68.15,17.3 78.5,28.55 60,20.45 62.3,20.15 56.9,13.6 50.55,41.65 50.35,36.9 47.35,48.45 45.5,48.05 47.1,44.05 53.35,46.05
  pour Top: 15.4,40.3 3.35,40.3 3.35,47.25 16.65,47.25 16.65,41.5 15.45,40.3
  pour Bottom: 15.4,40.3 3.35,40.3 3.35,47.25 16.65,47.25 16.65,41.5 15.45,40.3
  pour Top: -0.05,49.8 86.5,49.8 86.5,0.05 -0.1,0.05 -0.1,49.75
  pour Bottom: -0.05,49.75 86.5,49.75 86.5,0 -0.1,0 -0.1,49.7
LED1
  Top 0.254: R11.2 81.05,44.65 80.81,44.41 | 80.75,44.35 80.81,44.41 | 80.81,44.41 U$4.G+
LED2  (via drill 0.3)
  Top 0.254: R12.2 58.95,35.55 v58.9,35.5
  Bottom 0.254: v58.9,35.5 59.65,34.75 66.95,34.75 68.55,33.15 70.65,33.15 72.35,34.85 77.3,34.85 U$4.Y+
LED3  (via drill 0.3)
  Top 0.254: D3.C 34.45,5.65 v34.45,4.75 | v41.25,25.6 U$2.P$12
  Bottom 0.254: v34.45,4.75 34.45,23.9 36.15,25.6 v41.25,25.6
LED4  (via drill 0.3)
  Top 0.254: D4.C 36.8,5.65 v36.8,4.75 | v40.6,24.2 40.65,24.15 42.35,24.15 U$2.P$11
  Bottom 0.254: v36.8,4.75 36.8,23.1 37.9,24.2 v40.6,24.2
N$1
  Top 0.254: U$4.P4 66.58,39.12 68.36,40.9 70.25,40.9 C6.1
N$2
  Top 0.254: C7.1 70.16,36.1 U$4.P5
N$3
  Top 0.254: U$2.P$15 42.65,30.05 58.23,30.05 59.61,31.43 59.61,33.7 61.35,35.45 61.35,39.25 62.65,40.55 R2.1 62.65,41.05
N$4
  Top 0.254: U$2.P$16 42.85,31.2 43.55,30.5 57.95,30.5 59.2,31.75 59.2,33.95 60.9,35.65 R1.1
N$5
  Top 0.254: U$2.P$52 23.4,15.9 R5.3 19.2,15.9 19.05,16.05 19.05,17.8 18.28,18.57 U$3.2
N$6
  Top 0.254: 20.3,17.2 R5.4 | U$2.P$51 20.3,17.2 | 20.3,17.2 19.95,17.2 19.9,17.15 19.9,17.8 18.05,19.65 14.69,19.65 U$3.3
N$7  (via drill 0.35)
  Top 0.254: U$2.P$53 21.55,14.4 v21,14.95 20.85,15.1 R5.2 | U$3.1 16.28,17.47 v16.3,17.45
  Bottom 0.254: v16.3,17.45 18.8,14.95 v21,14.95
N$8
  Top 0.254: U$3.5 17.97,21.87 | 17.97,21.87 R70.4 | U$2.P$50 21.5,18.6 18.23,21.87 17.97,21.87
N$9  (via drill 0.35)
  Top 0.254: U$2.P$36 25.15,38.2 v25.2,38.25
  Bottom 0.254: v25.2,38.25 26.8,39.85 64.1,39.85 66.55,42.3 69.04,42.3 U$4.TD+
N$10
  Top 0.254: U1.6 20.5,42.77 24.74,42.77 26.2,41.3 38.7,41.3 39.3,41.9 U$2.P$24
  Top 0.508: U1.6 19.52,42.42 18.6,41.5 18.6,39.9 17.65,38.95 R19.2
N$11
  Top 0.254: U1.5 20.35,41.15 21.56,42.35 24.53,42.35 25.98,40.9 39.19,40.9 40.08,41.79 40.08,43.22 39.92,43.38 38.28,43.38 37.8,42.9 37.9,42.8 U$2.P$25
  Top 0.508: U1.5 19.85,40.85 R20.2
N$12
  Top 0.254: U$2.P$19 42.7,35.1 52.4,35.1 R4.1
N$13
  Top 0.254: R3.1 42.25,45.45 40.55,43.75 40.55,37.65 41.4,36.8 U$2.P$20
N$14  (via drill 0.35)
  Top 0.254: U$2.P$48 20.75,21.4 v20.55,21.6 | U$3.8 17.48,25.17 v17.9,24.75 18.1,24.55 R70.2
  Bottom 0.254: v20.55,21.6 17.9,24.25 v17.9,24.75
N$15  (via drill 0.3)
  Top 0.254: U$2.P$13 42.3,26.9 40.95,26.9 39.65,28.2 v39.65,37.6 | v64.85,37.15 66.85,37.15 68.15,38.45 75.6,38.45 78.65,41.5 78.65,46.7 R11.1
  Bottom 0.254: v39.65,37.6 64.4,37.6 v64.85,37.15
N$16  (via drill 0.35)
  Top 0.254: Q5.3 v61.05,18.95 R10.2 | U$8.1 53.75,17.25 54.6,17.25 v54.6,17.15
  Bottom 0.254: v54.6,17.15 59.25,17.15 v61.05,18.95
N$17
  Top 0.254: U$2.P$32 28.1,45.05 SV3.2
N$18
  Top 0.254: U$2.P$31 29.5,46.19 SV3.1
N$19
  Top 0.254: U$2.P$26 R16.1
N$20  (via drill 0.3)
  Top 0.254: U$2.P$9 41.4,21.4 40.85,20.85 v40.85,19.3 | v53.1,5 53.1,5.35 R18.1 54.2,5.5 S2.1
  Bottom 0.254: v40.85,19.3 40.85,15.95 38.45,13.55 38.45,5.5 40.1,3.85 51.7,3.85 52.85,5 v53.1,5
N$21  (via drill 0.35)
  Top 0.254: U$2.P$10 42.03,23.17 40.59,23.17 39.1,24.66 39.1,36.45 v38.95,36.6 | v49.35,36.94 49.35,39.3 R22.1
  Bottom 0.254: v38.95,36.6 39.32,36.97 39.91,36.97 40.14,37.2 49.1,37.2 v49.35,36.94
N$22
  Top 0.254: R13.1 32.45,3.15 34.05,3.15 D3.A
N$23
  Top 0.254: D4.A 38.8,2.7 R14.1
N$28  (via drill 0.3)
  Top 0.254: U$2.P$14 43.15,28.4 43.4,28.15 43.4,26.05 44.25,25.2 65.95,25.2 v66,25.15
  Bottom 0.254: S3.2 83.9,12 83.9,20.95 80.75,24.1 75.55,24.1 74.5,25.15 v66,25.15
N$29
  Top 0.508: Q4.1 13.1,8.55 | 13.1,8.55 R6.1 R9.1 | Q3.1 13.1,6.9 13.1,8.55
N$30
  Top 0.254: U$2.P$54 23.85,12.65 26.3,12.65 31.25,7.7 66.35,7.7 72,13.35 72,17.05 74.65,19.7 79.45,19.7 79.9,19.25 J2.D+
N$31
  Top 0.254: U$2.P$55 23.75,11.85 26.53,11.85 31.08,7.3 66.52,7.3 72.41,13.18 72.41,16.85 74.85,19.3 79.26,19.3 79.95,18.6 J2.D-
N$32
  Top 0.406: J2.VBUS 78.55,17.95 F1.1
  Top 1.016: F1.1 C10.+
N$33
  Top 0.254: U$2.P$47 22.55,22.8 21.6,23.75 21.6,26 21.35,26.25 18.9,26.25 | 18.9,26.25 14.69,26.25 U$3.CD | R70.1 18.9,25.5 18.9,26.25
N$34
  Top 0.254: U$2.P$49 20.7,20 19.8,20.9 19.8,23.35 19.4,23.75 R70.3 18.15,23.75 17.83,24.07 U$3.7
N$35
  Top 0.254: U1.2 13.79,43.69 13.23,43.13 Y1.X1
N$36
  Top 0.254: U1.1 14.05,44.96 13.33,45.67 Y1.X2
N$37  (via drill 0.35)
  Top 0.508: U1.3 15.67,42.42 v15.7,42.45 | BT1.P$1 45.7,32.35 v43.8,32.35 | C11.1 13,39.95 v13.03,39.93
  Bottom 0.508: v15.7,42.45 15.65,42.45 13.13,39.93 v13.03,39.93 12.25,39.15 12.25,35.9 13.35,34.8 40.95,34.8 43.4,32.35 v43.8,32.35
N$38
  Top 0.508: SV2.1 4.91,1.86 Q1.3
N$39  (via drill 0.35)
  Top 0.254: U$2.P$37 25,36.8 v25.45,37.25
  Bottom 0.254: v25.45,37.25 25.95,37.75 25.95,38.43 26.94,39.42 65.03,39.42 U$4.TD-
N$40  (via drill 0.35)
  Top 0.254: U$2.P$35 25.1,39.6 26.3,38.4 29.65,38.4 29.65,38.39 v29.8,38.24
  Bottom 0.254: v29.8,38.24 30.23,38.24 30.38,38.1 30.92,38.1 31.17,38.35 64.85,38.35 66.58,36.62 U$4.RD-
N$41
  Top 0.508: U$8.3 53.95,15.05 53.95,14.9
  Top 1.27: 53.95,14.9 53.95,14.2 54.97,13.18 U$9.P$1
N$42  (via drill 0.35)
  Top 0.254: U$2.P$34 24.4,41 26.5,38.9 30.65,38.9 v30.65,38.76
  Bottom 0.254: v30.65,38.76 65.46,38.76 66.4,39.7 69.1,39.7 U$4.RD+
N$43
  Top 0.508: SV2.3 4.99,6.94 Q2.3
N$45
  Top 0.254: U$2.P$17 42.65,32.6 43.65,33.6 53.8,33.6 57,36.8 R12.1
N$46
  Top 0.254: C24.2 56.35,20.65 R30.1 R31.2 U$8.6
RCD  (via drill 0.35)
  Top 0.254: v16.28,37.99 15.98,37.99 14.24,36.24 10.19,36.24 9.02,35.07 9.02,12.2 v9.37,11.85 | v17.55,8.55 R6.2
  Bottom 0.254: SV5.7 55.85,46.8 47.3,46.8 46.6,47.5 46.6,48.1 45.95,48.75 18.65,48.75 18.4,48.5 18.4,40.8 16.28,38.69 v16.28,37.99 | v9.37,11.85 12.67,8.55 v17.55,8.55
RST
  Top 0.254: R4.2 59.6,44.2 60.4,44.2 61.68,45.48 SV5.11
SPI2_SCK
  Top 0.254: SV5.4 50.85,46.78 50.85,45 50.75,44.9 50.75,42.9 R22.2
SWDIO  (via drill 0.35)
  Top 0.254: 63.2,22.35 R15.1 | R15.1 62.4,22.65 v62.3,22.75 | v51.25,36.4 51.25,44.64 SV5.3 | Q5.1 63.25,22.4 R15.1
  Bottom 0.254: v62.3,22.75 62.3,25.6 51.5,36.4 v51.25,36.4
U1_RX
  Top 0.254: R2.2 64.2,44.65 64.2,47.45 63.6,48.05 63.57,48.02 SV5.12
U1_TX
  Top 0.254: R1.2 60.9,43.65 61.5,44.25 62.9,44.25 63.5,44.85 63.5,46.25 62.95,46.8 60.95,46.8 59.73,48.02 SV5.10

### Text on the board
tNames: Prism Linux Board v1 | Cartender / Cristiano Griletti 2019
tValues: bordo esterno PCB